# Altium schematic sheet LED_Shield_PCB_v11.SchDoc
size A4; SheetNumber: 1; SheetTotal: 1
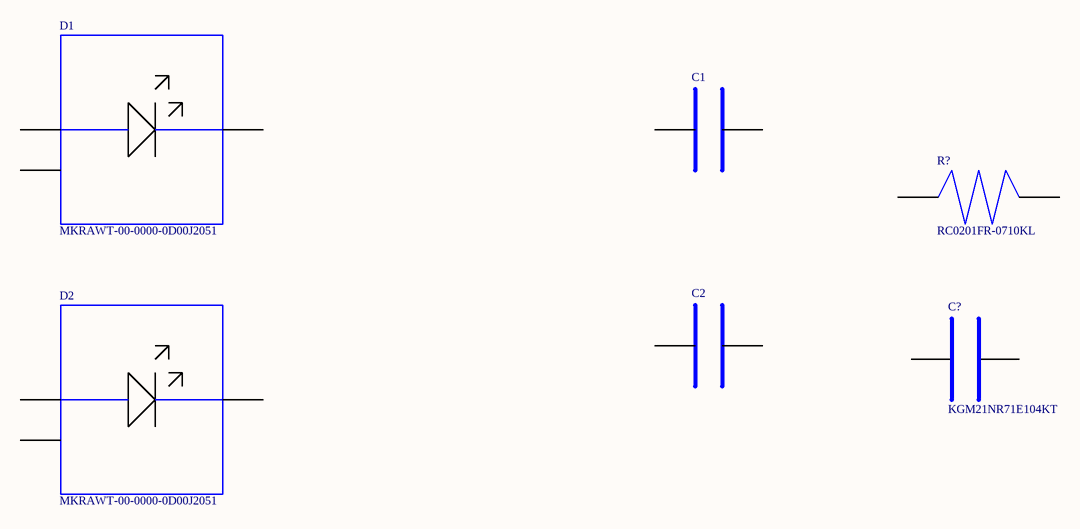
[diagram p0: LED_Shield_PCB_v11.SchDoc]

## Parts
C1  MSAST219LB5106KTNA01  [C_0805 (2012 Metric)]  (value not drawn)
C2  MSAST219LB5106KTNA01  [C_0805 (2012 Metric)]  (value not drawn)
C?  KGM21NR71E104KT  [C_0805 (2012 Metric)_2]
D1  MKRAWT-00-0000-0D00J2051  [MKRAWT-00-0000-0D00J2051]
D2  MKRAWT-00-0000-0D00J2051  [MKRAWT-00-0000-0D00J2051]
R?  RC0201FR-0710KL

## Nets

Not connected (* = marked no-connect by the designer): C1 0 1; C2 0 1; C? 0 1; D1 0 1 2; D2 0 1 2; R? 0 1

## Library data of the parts
C1 C2 = MSAST219LB5106KTNA01: Ceramic Capacitor, Multilayer, Ceramic, 25V, 10% +Tol, 10% -Tol, X5R, 15% TC, 10uF, Surface Mount, 0805; Manufacturer: TAIYO YUDEN; Value: 10µF; Supplier: Arrow Electronics; Supplier Part Number: MSAST219LB5106KTNA01; Manufacturer Part Number: MSAST219LB5106KTNA01; RoHS: Compliant; Category: Ceramic Capacitors; Stock: 7; Pricing: 1=0,0066 (USD); Dielectric Material: Ceramic; Export Control Classification Number (ECCN) Code: EAR99; Height: 850µm; Harmonized Tariff Schedule (HTS) Code: 8532.24.00.20; Introduction Date: 2022-02-17; Length: 2mm; Lifecycle Status: Production; Max Operating Temperature: 85°C; Min Operating Temperature: -55°C; Mounting Technology: Surface Mount; Number of Terminals: 2; REACH SVHC: Yes; Voltage Rating (DC): 25V; Width: 1.25mm; ComponentLink1URL: https://datasheet.octopart.com:443/MSAST219LB5106KTNA01-Taiyo-Yuden-datasheet-182126366.pdf?src-supplier=IHS; ComponentLink1Description: https://datasheet.octopart.com:443/MSAST219LB5106KTNA01-Taiyo-Yuden-datasheet-182126366.pdf?src-supplier=IHS
D1 D2 = MKRAWT-00-0000-0D00J2051: LED Lighting XLamp® MK-R White, Cool 6200K 12V 700mA 120° 2828 (7070 Metric); Manufacturer: Wolfspeed; Forward Current: 1.25A; Forward Voltage: 14V; Lens Color: Clear; Luminous Flux: 1.04klm; Luminous Intensity: 120cd; Number of Elements: 1; Reverse Voltage: 5V; Supplier: Arrow Electronics; Supplier Part Number: MKRAWT-00-0000-0D00J2051; Manufacturer Part Number: MKRAWT-00-0000-0D00J2051; RoHS: Compliant; Category: LEDs; Pricing: 1000=4,355, 2000=4,312, 3000=4,269, 4000=4,226, 5000=4,184, 6000=4,142, 10000=4,101, 20000=4,06, 25000=4,019 (USD); Case/Package: SMD/SMT; China RoHS: Compliant; Color: White; Height: 4.08mm; Illumination Color: White; Length: 7mm; Max Current Rating: 1.25A; Mounting Technology: Surface Mount; Pins: 2; REACH SVHC: Yes; Test Current: 700mA; Viewing Angle: 120°; Width: 7mm; ComponentLink1URL: https://datasheet.octopart.com:443/MKRAWT-00-0000-0D00J2051-Wolfspeed-datasheet-181532352.pdf?src-supplier=IHS; ComponentLink1Description: https://datasheet.octopart.com:443/MKRAWT-00-0000-0D00J2051-Wolfspeed-datasheet-181532352.pdf?src-supplier=IHS
R? = RC0201FR-0710KL: Res Thick Film 0201 10K Ohm 1% 0.05W(1/20W) ±200ppm/C Pad SMD T/R; Manufacturer: Yageo Group; Max Power Dissipation: 50mW; Value: 10kΩ; Temperature Coefficient: 200ppm/°C; Voltage Rating: 25V; Supplier: Farnell; Supplier Part Number: 1857008; Manufacturer Part Number: RC0201FR-0710KL; RoHS: Compliant; Category: Chip SMD Resistors; Stock: 170907; Pricing: 10=0,0092, 100=0,0072, 500=0,0059, 2500=0,0046, 5000=0,0045 (EUR); Case/Package: 0201; Case Code (Imperial): 0201; Case Code (Metric): 0603; China RoHS: Non-Compliant; Composition: Thick Film; Contact Plating: Tin; Country of Origin: Mainland China, Taiwan; Depth: 300µm; Export Control Classification Number (ECCN) Code: EAR99; Features: Moisture Resistant; Height: 230µm; Harmonized Tariff Schedule (HTS) Code: 8533.21.00.30; Introduction Date: 2008-07-18; Lead Free: Lead Free; Length: 600µm; Lifecycle Status: Production; Max Operating Temperature: 125°C; Military Standard: Not; Min Operating Temperature: -55°C; Mounting Technology: Surface Mount; Pins: 2; Number of Terminals: 2; Number of Terminations: 2; Packaging: Tape & Reel; Power Dissipation: 50mW; Power Rating: 50mW; Radiation Hardening: No; REACH SVHC: Yes; Schedule B: 8533210045, 8533210045|8533210045|8533210045|8533210045|8533210045|8533210045|8533210045|8533210045|8533210045|8533210045|8533210045|8533210045|8533210045|8533210045|8533210045|8533210045|8533210045|8533210045|8533210045, 8533210045|8533210045|8533210045|8533210045|8533210045|8533210045|8533210045|8533210045|8533210045|8533210045|8533210045|8533210045|8533210045|8533210045|8533210045|8533210045|8533210045|8533210045|8533210045|8533210045, 8533210045|8533210045|8533210045|8533210045|8533210045|8533210045|8533210045|8533210045|8533210045|8533210045|8533210045|8533210045|8533210045|8533210045|8533210045|8533210045|8533210045|8533210045|8533210045|8533210045|8533210045; Termination: SMD/SMT; Tolerance: 1%; Voltage Rating (DC): 25V; Weight: 170.097139µg; Width: 300µm; Working Voltage: 25V; ComponentLink1URL: https://datasheet.octopart.com:443/RC0201FR-0710KL-Yageo-datasheet-175887523.pdf?src-supplier=IHS; ComponentLink1Description: https://datasheet.octopart.com:443/RC0201FR-0710KL-Yageo-datasheet-175887523.pdf?src-supplier=IHS; ComponentLink2URL: https://datasheet.octopart.com:443/RC0201FR-0710KL-Yageo-datasheet-12509713.pdf?src-supplier=element14+APAC; ComponentLink2Description: https://datasheet.octopart.com:443/RC0201FR-0710KL-Yageo-datasheet-12509713.pdf?src-supplier=element14+APAC; ComponentLink3URL: https://datasheet.octopart.com:443/RC0201FR-0710KL-Yageo-datasheet-62067350.pdf?src-supplier=element14+APAC; ComponentLink3Description: https://datasheet.octopart.com:443/RC0201FR-0710KL-Yageo-datasheet-62067350.pdf?src-supplier=element14+APAC; ComponentLink4URL: https://datasheet.octopart.com:443/RC0201FR-0710KL-Yageo-datasheet-10911895.pdf?src-supplier=element14+APAC; ComponentLink4Description: https://datasheet.octopart.com:443/RC0201FR-0710KL-Yageo-datasheet-10911895.pdf?src-supplier=element14+APAC; ComponentLink5URL: https://datasheet.octopart.com:443/RC0201FR-0710KL-Yageo-datasheet-13314888.pdf?src-supplier=Upverter; ComponentLink5Description: https://datasheet.octopart.com:443/RC0201FR-0710KL-Yageo-datasheet-13314888.pdf?src-supplier=Upverter; ComponentLink6URL: https://datasheet.octopart.com:443/RC0201FR-0710KL-Yageo-datasheet-12549147.pdf?src-supplier=Upverter; ComponentLink6Description: https://datasheet.octopart.com:443/RC0201FR-0710KL-Yageo-datasheet-12549147.pdf?src-supplier=Upverter; ComponentLink7URL: https://datasheet.octopart.com:443/RC0201FR-0710KL-Yageo-datasheet-12509741.pdf?src-supplier=Upverter; ComponentLink7Description: https://datasheet.octopart.com:443/RC0201FR-0710KL-Yageo-datasheet-12509741.pdf?src-supplier=Upverter; ComponentLink8URL: https://datasheet.octopart.com:443/RC0201FR-0710KL-Yageo-Group-datasheet-190305687.pdf?src-supplier=Newark; ComponentLink8Description: https://datasheet.octopart.com:443/RC0201FR-0710KL-Yageo-Group-datasheet-190305687.pdf?src-supplier=Newark; ComponentLink9URL: https://datasheet.octopart.com:443/RC0201FR-0710KL-Yageo-datasheet-10025917.pdf?src-supplier=Newark; ComponentLink9Description: https://datasheet.octopart.com:443/RC0201FR-0710KL-Yageo-datasheet-10025917.pdf?src-supplier=Newark; ComponentLink10URL: https://datasheet.octopart.com:443/RC0201FR-0710KL-Yageo-Group-datasheet-176638170.pdf?src-supplier=Future+Electronics; ComponentLink10Description: https://datasheet.octopart.com:443/RC0201FR-0710KL-Yageo-Group-datasheet-176638170.pdf?src-supplier=Future+Electronics; ComponentLink11URL: https://datasheet.octopart.com:443/RC0201FR-0710KL-Yageo-datasheet-164759695.pdf?src-supplier=Future+Electronics; ComponentLink11Description: https://datasheet.octopart.com:443/RC0201FR-0710KL-Yageo-datasheet-164759695.pdf?src-supplier=Future+Electronics; ComponentLink12URL: https://datasheet.octopart.com:443/RC0201FR-0710KL-Yageo-datasheet-127823281.pdf?src-supplier=Future+Electronics; ComponentLink12Description: https://datasheet.octopart.com:443/RC0201FR-0710KL-Yageo-datasheet-127823281.pdf?src-supplier=Future+Electronics; ComponentLink13URL: https://datasheet.octopart.com:443/RC0201FR-0710KL-Yageo-datasheet-137700087.pdf?src-supplier=Future+Electronics; ComponentLink13Description: https://datasheet.octopart.com:443/RC0201FR-0710KL-Yageo-datasheet-137700087.pdf?src-supplier=Future+Electronics; ComponentLink14URL: https://datasheet.octopart.com:443/RC0201FR-0710KL-Yageo-datasheet-103092701.pdf?src-supplier=Future+Electronics; ComponentLink14Description: https://datasheet.octopart.com:443/RC0201FR-0710KL-Yageo-datasheet-103092701.pdf?src-supplier=Future+Electronics; ComponentLink15URL: https://datasheet.octopart.com:443/RC0201FR-0710KL-Yageo-datasheet-98239111.pdf?src-supplier=Future+Electronics; ComponentLink15Description: https://datasheet.octopart.com:443/RC0201FR-0710KL-Yageo-datasheet-98239111.pdf?src-supplier=Future+Electronics; ComponentLink16URL: https://datasheet.octopart.com:443/RC0201FR-0710KL-Yageo-datasheet-44382975.pdf?src-supplier=Future+Electronics; ComponentLink16Description: https://datasheet.octopart.com:443/RC0201FR-0710KL-Yageo-datasheet-44382975.pdf?src-supplier=Future+Electronics; ComponentLink17URL: https://datasheet.octopart.com:443/RC0201FR-0710KL-Yageo-datasheet-41589693.pdf?src-supplier=Future+Electronics; ComponentLink17Description: https://datasheet.octopart.com:443/RC0201FR-0710KL-Yageo-datasheet-41589693.pdf?src-supplier=Future+Electronics; ComponentLink18URL: https://datasheet.octopart.com:443/RC0201FR-0710KL-Yageo-datasheet-37140709.pdf?src-supplier=Future+Electronics; ComponentLink18Description: https://datasheet.octopart.com:443/RC0201FR-0710KL-Yageo-datasheet-37140709.pdf?src-supplier=Future+Electronics; ComponentLink19URL: https://datasheet.octopart.com:443/RC0201FR-0710KL-Yageo-datasheet-12509768.pdf?src-supplier=Future+Electronics; ComponentLink19Description: https://datasheet.octopart.com:443/RC0201FR-0710KL-Yageo-datasheet-12509768.pdf?src-supplier=Future+Electronics; ComponentLink20URL: https://datasheet.octopart.com:443/RC0201FR-0710KL-Yageo-datasheet-12590898.pdf?src-supplier=Future+Electronics; ComponentLink20Description: https://datasheet.octopart.com:443/RC0201FR-0710KL-Yageo-datasheet-12590898.pdf?src-supplier=Future+Electronics; ComponentLink21URL: https://datasheet.octopart.com:443/RC0201FR-0710KL-Yageo-datasheet-5319114.pdf?src-supplier=Future+Electronics; ComponentLink21Description: https://datasheet.octopart.com:443/RC0201FR-0710KL-Yageo-datasheet-5319114.pdf?src-supplier=Future+Electronics; ComponentLink22URL: https://datasheet.octopart.com:443/RC0201FR-0710KL-Yageo-datasheet-12535854.pdf?src-supplier=Future+Electronics; ComponentLink22Description: https://datasheet.octopart.com:443/RC0201FR-0710KL-Yageo-datasheet-12535854.pdf?src-supplier=Future+Electronics; ComponentLink23URL: https://datasheet.octopart.com:443/RC0201FR-0710KL-Yageo-datasheet-148775077.pdf?src-supplier=TME; ComponentLink23Description: https://datasheet.octopart.com:443/RC0201FR-0710KL-Yageo-datasheet-148775077.pdf?src-supplier=TME; ComponentLink24URL: https://datasheet.octopart.com/RC0201FR-0710KL-Yageo-datasheet-73766026.pdf; ComponentLink24Description: https://datasheet.octopart.com/RC0201FR-0710KL-Yageo-datasheet-73766026.pdf; ComponentLink25URL: https://datasheet.octopart.com:443/RC0201FR-0710KL-Yageo-datasheet-8701561.pdf?src-supplier=element14; ComponentLink25Description: https://datasheet.octopart.com:443/RC0201FR-0710KL-Yageo-datasheet-8701561.pdf?src-supplier=element14; ComponentLink26URL: http://sigma.octopart.com:80/conflict_mineral_statement/Yageo-company-3.pdf?src-supplier=Compliance+Statements; ComponentLink26Description: http://sigma.octopart.com:80/conflict_mineral_statement/Yageo-company-3.pdf?src-supplier=Compliance+Statements; ComponentLink27URL: http://sigma.octopart.com:80/rohs_statement/Yageo-company-2.pdf?src-supplier=Compliance+Statements; ComponentLink27Description: http://sigma.octopart.com:80/rohs_statement/Yageo-company-2.pdf?src-supplier=Compliance+Statements